# EAGLE schematic Jig-Middle-Layer (EAGLE 7.7.0)
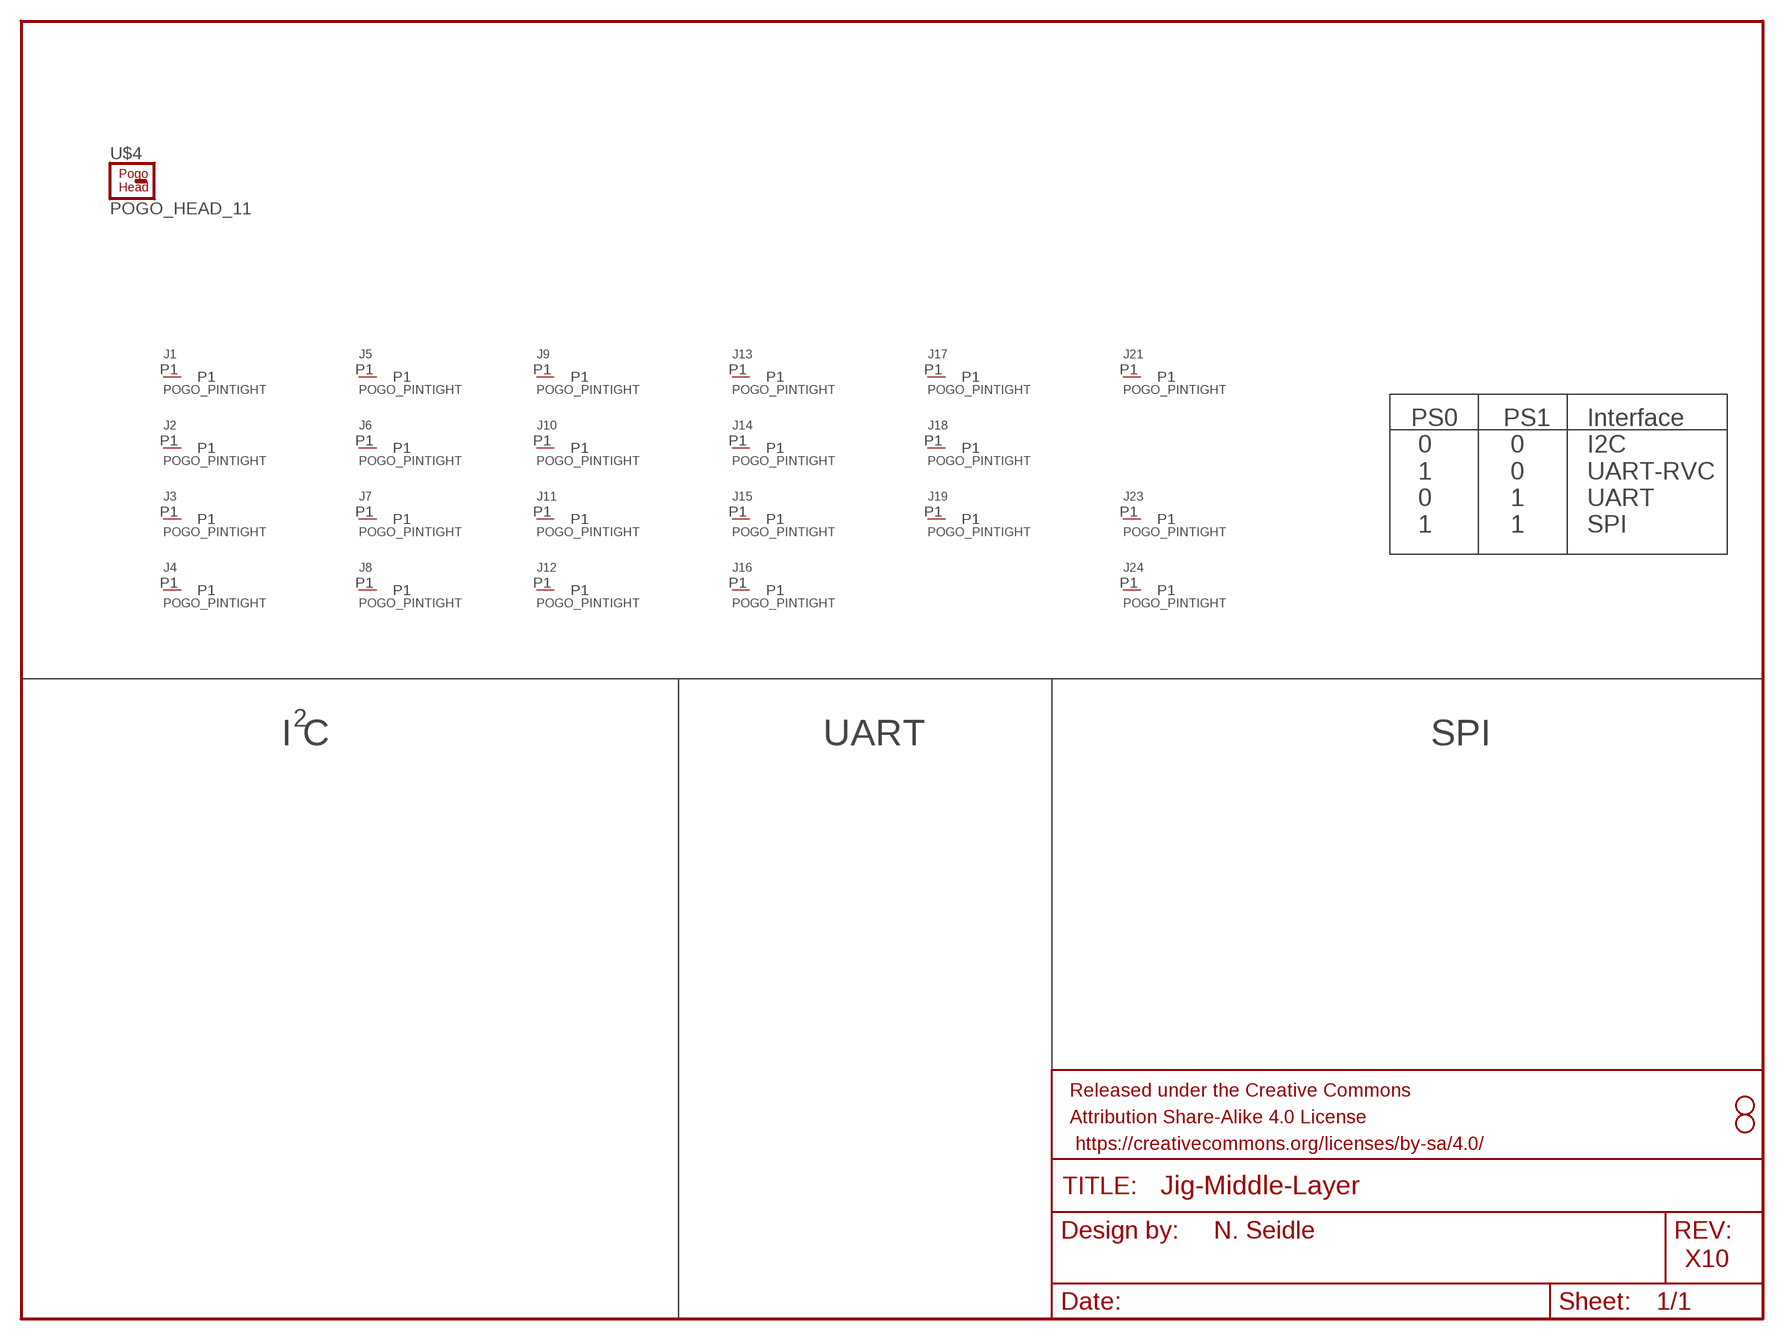
[diagram p0: schematic, sheet 1]

## Parts
FRAME1  FRAME-LETTER  [CREATIVE_COMMONS]
J1  POGO_PINTIGHT  [POGO_PIN_TIGHT]
J2  POGO_PINTIGHT  [POGO_PIN_TIGHT]
J3  POGO_PINTIGHT  [POGO_PIN_TIGHT]
J4  POGO_PINTIGHT  [POGO_PIN_TIGHT]
J5  POGO_PINTIGHT  [POGO_PIN_TIGHT]
J6  POGO_PINTIGHT  [POGO_PIN_TIGHT]
J7  POGO_PINTIGHT  [POGO_PIN_TIGHT]
J8  POGO_PINTIGHT  [POGO_PIN_TIGHT]
J9  POGO_PINTIGHT  [POGO_PIN_TIGHT]
J10  POGO_PINTIGHT  [POGO_PIN_TIGHT]
J11  POGO_PINTIGHT  [POGO_PIN_TIGHT]
J12  POGO_PINTIGHT  [POGO_PIN_TIGHT]
J13  POGO_PINTIGHT  [POGO_PIN_TIGHT]
J14  POGO_PINTIGHT  [POGO_PIN_TIGHT]
J15  POGO_PINTIGHT  [POGO_PIN_TIGHT]
J16  POGO_PINTIGHT  [POGO_PIN_TIGHT]
J17  POGO_PINTIGHT  [POGO_PIN_TIGHT]
J18  POGO_PINTIGHT  [POGO_PIN_TIGHT]
J19  POGO_PINTIGHT  [POGO_PIN_TIGHT]
J21  POGO_PINTIGHT  [POGO_PIN_TIGHT]
J23  POGO_PINTIGHT  [POGO_PIN_TIGHT]
J24  POGO_PINTIGHT  [POGO_PIN_TIGHT]
JP3  STAND-OFF  [STAND-OFF]
JP4  STAND-OFF  [STAND-OFF]
U$4  POGO_HEAD_11  [1X01_POGO_HEAD]
Unconnected: J1.P1 J2.P1 J3.P1 J4.P1 J5.P1 J6.P1 J7.P1 J8.P1 J9.P1 J10.P1 J11.P1 J12.P1 J13.P1 J14.P1 J15.P1 J16.P1 J17.P1 J18.P1 J19.P1 J21.P1 J23.P1 J24.P1

## Notes on the sheet
- PS0
   0
   1
   0
   1
- PS1
   0
   0
   1
   1
- Interface
  I2C
  UART-RVC
  UART
  SPI
- 2
- I C | UART | SPI
- N. Seidle
- X10

## Library data of the parts
FRAME1 = SparkFun-Aesthetics:FRAME-LETTER: Schematic Frame - Letter Standard 8.5x11 US Letter frame
J1-J19 J21 J23 J24 = KevinKuwata_eagle:POGO_PIN
JP3 JP4 = SparkFun:STAND-OFF: Stand Off This is the mechanical footprint for a #4 phillips button head screw. Use the keepout ring to avoid running the screw head into surrounding components. SKU : PRT-00447
U$4 = Pogo-Footprints:POGO_HEAD_1